# Altium schematic sheet Control_Sense_BOTT.SchDoc (part 5 of 5)
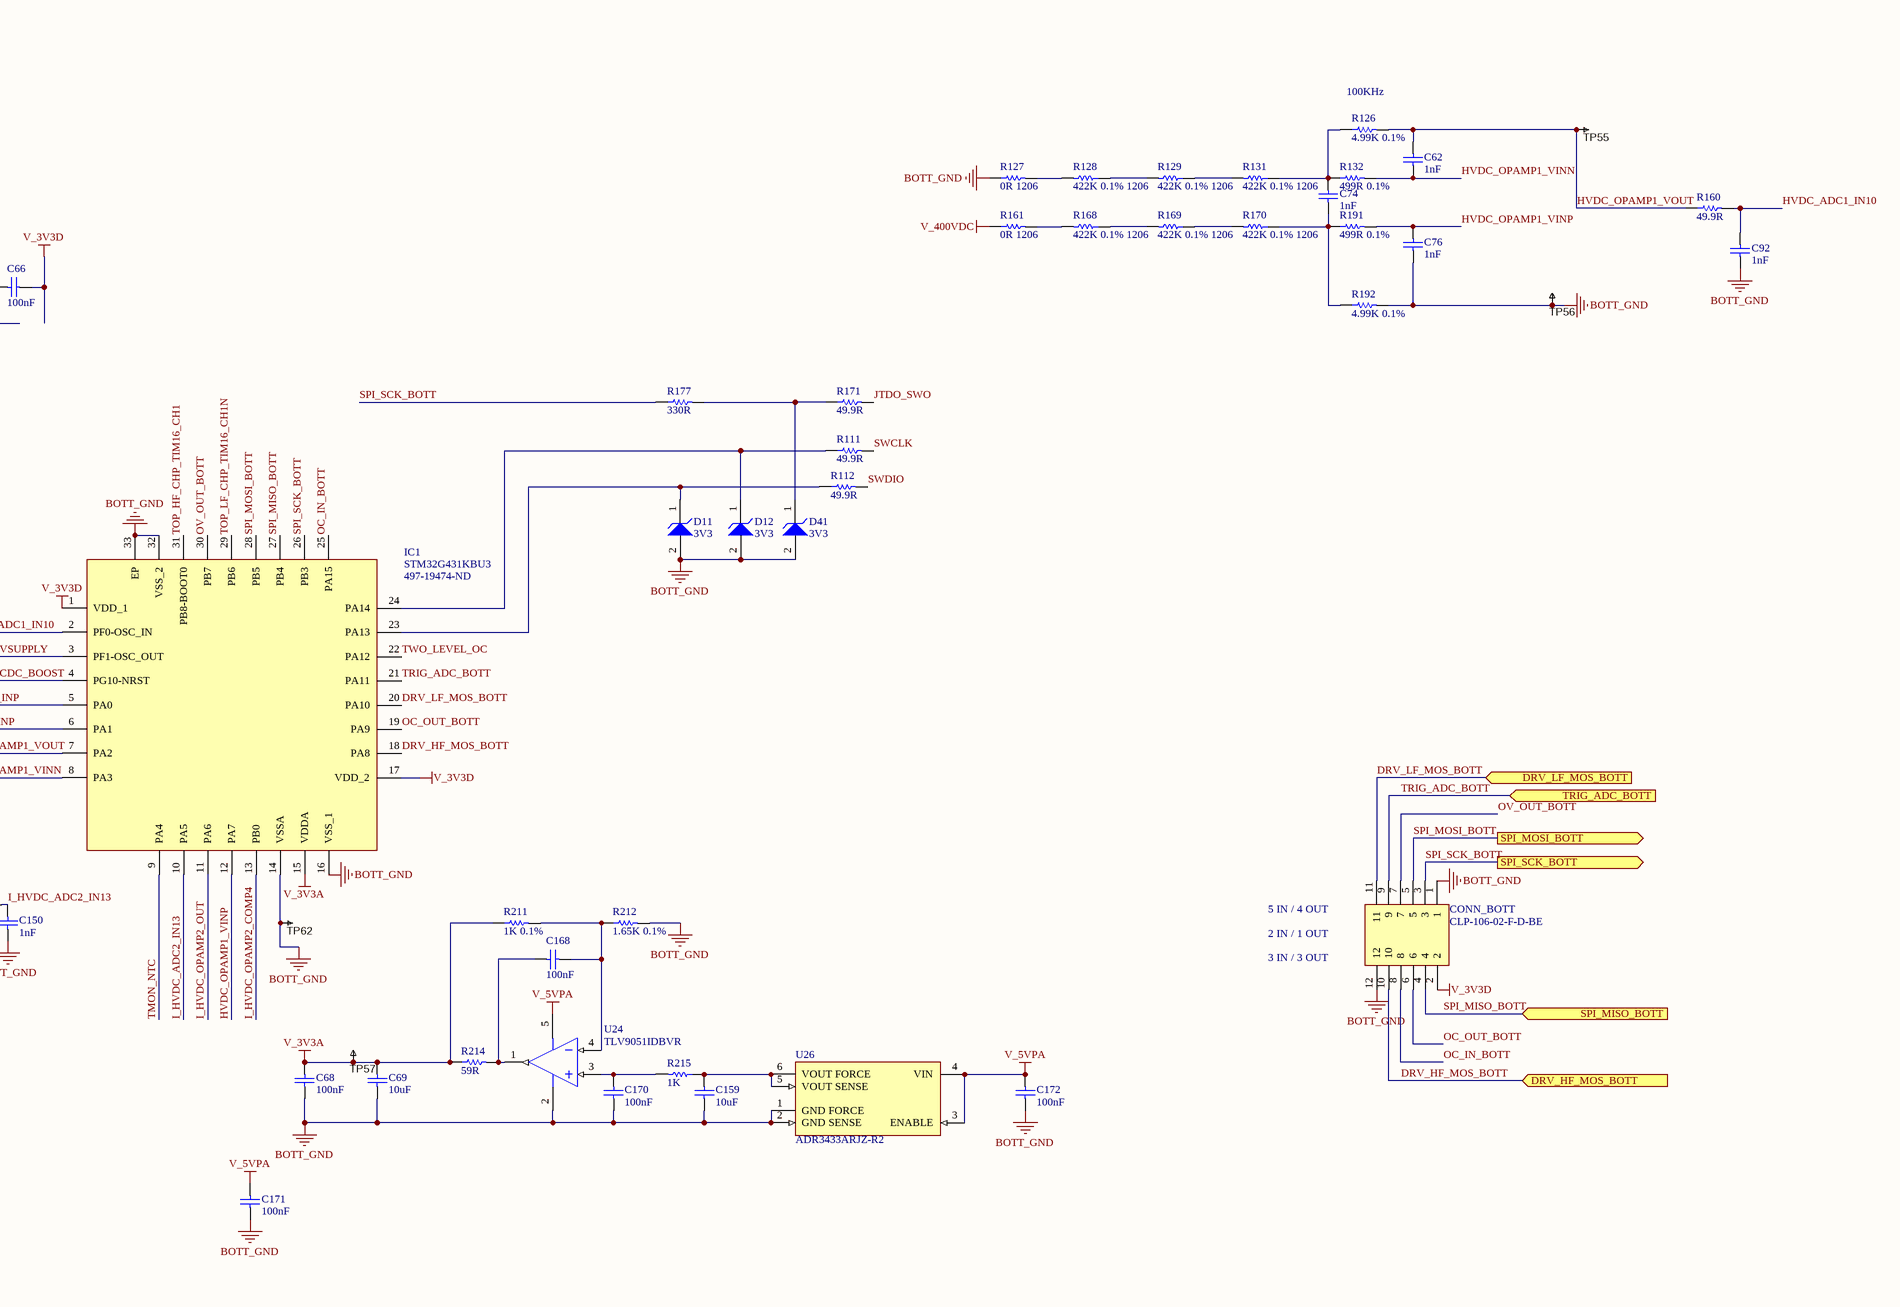
[diagram p9: Control_Sense_BOTT.SchDoc, bottom right]

## Library data of the parts (continued)
R257 = RES-2: Chip Resistor, 0 Ohm, +/- 5%, 0.1 W, -55 to 155 degC, 0603 (1608 Metric), RoHS, Tape and Reel; Manufacturer: Yageo; Manufacturer Part Number: RC0603JR-070RL; Temperature Coefficient: 200ppm/degreesC; Voltage Rating: 50V; Power Rating: 100mW; Resistance: 0mOhm; Width: 0.8mm; Max Operating Temperature: 155degC; Tolerance: 5%; Package Reference: 0603; Height: 0.45mm; Depth: 0.8mm; Package Description: 2-Pin Surface Mount Device, Body 1.6 x 0.8 mm; Termination: SMD/SMT; Package Quantity: 5000; Case/Package: 0603; Case Code (Imperial): 0603; Radiation Hardening: No; Number of Pins: 2; Length: 1.6mm; Lead Free: LeadFree; Voltage Rating (DC): 50V; Military Standard: Not; Datasheet URL: http://www.yageo.com/NewPortal/yageodocoutput?fileName=/pdf/R-Chip/PYu-RC_Group_51_RoHS_L_5.pdf; Manufacturer URL: http://www.yageo.com/; Packaging: TapeandReel; Case Code (Metric): 1608; Min Operating Temperature: -55degC; Composition: ThickFilm; RoHSCompliant: true; Contact Plating: Tin; Datasheet Version: Rev. 5, 10/2016; REACH SVHC: NoSVHC; Supplier 1: Avnet; Supplier Part Number 1: RC0603JR-070RL; RoHS: Yes; Category: Chip SMD Resistors; Stock 1: 1330000; Pricing 1: 5000=0.00138, 10000=0.00136, 20000=0.00132, 30000=0.00129, 40000=0.00124, 50000=0.00121, 500000=0.00118 (USD); Size Code: 0603; Resistor Type: Thick Film; Series: RC; Max Power Dissipation: 100mW; Construction: Rectangular; Number of Terminations: 2; Features: Moisture Resistant; Technology: THICK FILM; Resistance Tolerance: 5%; RoHS Compliant: Yes; ComponentLink1URL: https://datasheet.ciiva.com/11808/pyu-r-int-6-11808700.pdf?src-supplier=RSComponents; ComponentLink1Description: https://datasheet.ciiva.com/11808/pyu-r-int-6-11808700.pdf?src-supplier=RSComponents; ComponentLink2URL: https://datasheet.ciiva.com/22747/443971-22747530.pdf?src-supplier=Element14; ComponentLink2Description: https://datasheet.ciiva.com/22747/443971-22747530.pdf?src-supplier=Element14; ComponentLink3URL: https://datasheet.ciiva.com/12555/rc0603-272842-12555254.pdf?src-supplier=Mouser; ComponentLink3Description: https://datasheet.ciiva.com/12555/rc0603-272842-12555254.pdf?src-supplier=Mouser; ComponentLink4URL: https://datasheet.ciiva.com/7746/1738695-7746421.pdf?src-supplier=Element14; ComponentLink4Description: https://datasheet.ciiva.com/7746/1738695-7746421.pdf?src-supplier=Element14; ComponentLink5URL: https://datasheet.ciiva.com/7746/1738695-7746422.pdf?src-supplier=Element14; ComponentLink5Description: https://datasheet.ciiva.com/7746/1738695-7746422.pdf?src-supplier=Element14; ComponentLink6URL: https://datasheet.ciiva.com/8883/pyu-rc0603-51-rohs-l-4-8883045.pdf?src-supplier=Avnet; ComponentLink6Description: https://datasheet.ciiva.com/8883/pyu-rc0603-51-rohs-l-4-8883045.pdf?src-supplier=Avnet; ComponentLink7URL: https://datasheet.ciiva.com/15189/getdatasheetpartid-329462-15189845.pdf?src-supplier=Verical; ComponentLink7Description: https://datasheet.ciiva.com/15189/getdatasheetpartid-329462-15189845.pdf?src-supplier=Verical
R258 = RES: ±1% ±400ppm/℃ 5.1Ω 0.1W 0603 Chip Resistor - Surface Mount ROHS; Part Number: ERJ3EKF1803V; Manufacturer: Panasonic; Manufacturer Part Number: ERJ-3EKF1803V; Resistance: 180kR; Power Rating: 100mW; Voltage Rating: 75V; Temperature Coefficient: 100ppm/°C; Supplier 1: Digi-Key; Supplier Part Number 1: P180KHCT-ND; RoHS: Yes; Category: Chip SMD Resistors; Stock 1: 113875; Pricing 1: 1=0.10000, 10=0.06100, 100=0.02460, 1000=0.01106, 2500=0.00960 (USD); Mount: Surface Mount; Case/Package: 0603; Case Code (Metric): 1608; Case Code (Imperial): 0603; Contact Plating: Tin; Weight: 7.1E-05oz; Min Operating Temperature: -55°C; Max Operating Temperature: 155°C; Tolerance: 1%; Packaging: Tape and Reel; Resistor Type: Thick Film; Series: ERJ; Package Quantity: 1; Number of Terminations: 2; Termination: SMD/SMT; Max Power Dissipation: 100mW; Voltage Rating (DC): 75V; Construction: Rectangular; Features: Automotive AEC-Q200; Resistance Tolerance: 1%; Length: 1.6mm; Width: 0.031inch; Height: 0.022inch; Depth: 0.8mm; Radiation Hardening: No; RoHS Compliant: Yes; Military Standard: Not; Lead Free: Lead Free; REACH SVHC: No SVHC; ComponentLink1URL: https://datasheet.ciiva.com/22739/426256-22739797.pdf?src-supplier=Element14; ComponentLink1Description: https://datasheet.ciiva.com/22739/426256-22739797.pdf?src-supplier=Element14; ComponentLink2URL: https://datasheet.ciiva.com/24162/aoa0000ce2-24162661.pdf?src-supplier=Mouser; ComponentLink2Description: https://datasheet.ciiva.com/24162/aoa0000ce2-24162661.pdf?src-supplier=Mouser; ComponentLink3URL: https://datasheet.ciiva.com/30137/aoa0000ce2-30137813.pdf?src-supplier=Onlinecomponents.com; ComponentLink3Description: https://datasheet.ciiva.com/30137/aoa0000ce2-30137813.pdf?src-supplier=Onlinecomponents.com; ComponentLink4URL: https://datasheet.ciiva.com/46436/1678782-46436790.pdf?src-supplier=Element14; ComponentLink4Description: https://datasheet.ciiva.com/46436/1678782-46436790.pdf?src-supplier=Element14; ComponentLink5URL: https://datasheet.ciiva.com/46436/1678782-46436791.pdf?src-supplier=Element14; ComponentLink5Description: https://datasheet.ciiva.com/46436/1678782-46436791.pdf?src-supplier=Element14; ComponentLink6URL: https://datasheet.ciiva.com/16782/70260748-16782408.pdf?src-supplier=Allied+Electronics; ComponentLink6Description: https://datasheet.ciiva.com/16782/70260748-16782408.pdf?src-supplier=Allied+Electronics; ComponentLink7URL: https://datasheet.ciiva.com/17207/aoa0000ce2-17207208.pdf?src-supplier=Avnet+Europe; ComponentLink7Description: https://datasheet.ciiva.com/17207/aoa0000ce2-17207208.pdf?src-supplier=Avnet+Europe; ComponentLink8URL: https://datasheet.ciiva.com/28568/1678782-28568699.pdf?src-supplier=Element14; ComponentLink8Description: https://datasheet.ciiva.com/28568/1678782-28568699.pdf?src-supplier=Element14; ComponentLink9URL: https://datasheet.ciiva.com/5915/aoa0000ce2-5915294.pdf?src-supplier=Farnell; ComponentLink9Description: https://datasheet.ciiva.com/5915/aoa0000ce2-5915294.pdf?src-supplier=Farnell; ComponentLink10URL: https://datasheet.ciiva.com/9184/aoa0000ce2-9184911.pdf?src-supplier=Avnet; ComponentLink10Description: https://datasheet.ciiva.com/9184/aoa0000ce2-9184911.pdf?src-supplier=Avnet; Parameter 1: *; JLCPCB Part #: C25197
R262 R263 = CMP-2001-00026-5: ±1% 2kΩ ±100ppm/℃ 0.125W 0805 Chip Resistor - Surface Mount ROHS; Manufacturer: Panasonic; Voltage Rating: 150 V; RoHSCompliant: true; Packaging: Tape and Reel; ComponentLink2Description: Datasheet; DatasheetVersion: 04/2015; Min Operating Temperature: -55 degC; Max Operating Temperature: 155 degC; Mounting Technology: Surface Mount; Length: 2 mm; Package Quantity: 5000; REACH SVHC: Unknown; ComponentLink1URL: http://www.panasonic.com/; ComponentLink2URL: http://industrial.panasonic.com/cdbs/www-data/pdf/RDA0000/AOA0000C86.pdf; Mount: Surface Mount; PackageReference: 0805; ComponentLink1Description: Manufacturer URL; PackageDescription: 2-Pin Surface Mount Device, Body 2 x 1.25 mm; Height: 0.6 mm; JLCPCB Part #: C17604
TP41-TP62 = TESTPOINT: SMD test pin
U3 = TI-LP2951-D8: Single Output LDO, 100 mA, 1.2 to 29 V Output, 2 to 30 V Input, -40 to 125 degC, 8-Pin SOIC (D), RoHS, Tape and Reel; Manufacturer: Texas Instruments; Iq (Typ) (mA): 0.075; Output Options: Adjustable Output; Output Capacitor Type: Non-Ceramic; Vdo (Typ) (mV): 380; Vin (Max) (V): 30; Vout (Min) (V): 1.2; Vin (Min) (V): 2; Rating: Catalog; Accuracy (%): 1.4; Iout (Max) (A): 0.1; Vout (Max) (V): 29; ComponentLink1URL: http://www.ti.com/; PackageReference: D0008A; Operating Temperature Range (C): -40 to 125; ComponentLink3Description: Package Specification; ComponentLink1Description: Manufacturer URL; ComponentLink2URL: http://www.ti.com/lit/ds/symlink/lp2950-30.pdf; DatasheetVersion: SLVS582H; ComponentLink2Description: Datasheet; RoHS: TRUE; Packing: Tape and Reel; PartNumber: LP2951DR; PackageVersion: 4040047-3/M; Mounting Technology: Surface Mount; PackageDescription: 8-Pin Plastic Small Outline, Body 3.9 x 4.9 mm, Pitch 1.27 mm; ComponentLink3URL: http://www.ti.com/lit/ml/msoi002j/msoi002j.pdf
U6 U7 = CMP-0366-01377-2: Adjustable Precision Shunt Regulator, 34 ppm / degC, 100 mA, -40 to 85 degC, 3-pin SOT-89 (PK), Green (RoHS & no Sb/Br); Manufacturer: Texas Instruments; Rating: Military; SubFamily: Shunt Voltage Reference; Min Iz for Regulation(uA): 600; Initial Accuracy @ 25/deg C(%): 2; Temp Coeff(Typ)(ppm/ degree C): 34; Temp Coeff(Max)(ppm/ degree C): 92; VO Adj(Min)(V): 2.495; Iout/Iz(Max)(mA): 100; VO Adj(Max)(V): 36; Eco-Plan: Green (RoHS & no Sb/Br); Code_JEDEC: TO-243; DatasheetVersion: SLVS543M; ComponentLink1URL: http://www.ti.com/; PackageReference: PK0003A; PackageDescription: 3-Pin Plastic Small Outline, Body 2.5 x 4.5 mm, Pitch 1.5 mm; PackageVersion: 4040234/D; ComponentLink3URL: http://www.ti.com/litv/pdf/mhsi001b; PartNumber: TL431IPK; ComponentLink3Description: Package Specification; ComponentLink2URL: http://www.ti.com/general/docs/lit/getliterature.tsp?genericPartNumber=TL431&fileType=pdf; Mounting Technology: Surface Mount; ComponentLink2Description: Datasheet; ComponentLink1Description: Manufacturer URL
U10 U15 = CMP-0859-00394-3: Single 2-Input Positive-AND Gate, DCK0005A, SMALL T&R; Generic Part Number: SN74AHC1G08; Manufacturer: Texas Instruments; Schmitt Trigger: No; ICC @ Nom Voltage(Max)(mA): 0.01; Technology Family: AHC; Output Drive (IOL/IOH)(Max)(mA): 50/-50; tpd @ Nom Voltage(Max)(ns): 12.3,7.9; Logic: True; Gate Type: AND; VCC(Min)(V): 2; Input Type: CMOS; Voltage(Nom)(V): 3.3,5; Bits(#): 1; VCC(Max)(V): 5.5; F @ Nom Voltage(Max)(Mhz): 75; Rating: Catalog; 3-State Output: No; Operating Temperature Range(C): -55 to 125; DatasheetVersion: SCLS314N; Sub-Family: AND Gate; Output Type: CMOS; PackageReference: DCK0005A
U11 U16 = CMP-0859-00258-3: Single Bus Buffer Gate With 3-State Output, DCK0005A, LARGE T&R; Manufacturer: Texas Instruments; Bits(#): 1; 3-State Output: Yes; Input Type: CMOS; VCC(Min)(V): 2; Schmitt Trigger: No; Rating: Catalog; tpd @ Nom Voltage(Max)(ns): 6; Voltage(Nom)(V): 5; Technology Family: AHCT; ICC @ Nom Voltage(Max)(mA): 0.01; Output Drive (IOL/IOH)(Max)(mA): 8/-8; Sub-Family: Non-Inverting Buffer/Driver; VCC(Max)(V): 5.5; F @ Nom Voltage(Max)(Mhz): 75; Logic: True; Generic Part Number: SN74AHCT1G126; Operating Temperature Range(C): -40 to 125; Output Type: CMOS; PackageReference: DCK0005A; DatasheetVersion: SCLS380J
U14 = PM-LINEREG-TC1014-IL5: 50 mA, 100 mA and 150 mA CMOS LDOs with Active-Low Shutdown and Reference Bypass, 5-Pin SOT-23, Extended Temperature, Tape and Reel; PackageVersion: revBB, Aug-2009; Code_IPC: SOT23-5; PackageDescription: 5-Lead Plastic Small Outline Transistor (CT) [SOT-23]; DatasheetVersion: revE, Feb-2007; PackageReference: SOT-23-CT5
U23 = PM-CHP-LM2661M-8: Switched Capacitor Voltage Converter, 8-pin Narrow SOIC, Pb-Free; Manufacturer: Texas Instruments; PackageTopMarking: NSZXTT*LM26*63M; CompType: Switch Caps; PowerWise: N; Code_IPC: SOIC127P600-8; PinCount: 8; ComponentLink1Description: Datasheet URL; PackageReference: D0008A; Code_JEDEC: MS-012-AA; PackageDescription: SOIC Narrow, 4.9 x 3.9 x 1.45mm, 8 Lead, 1.27mm Pitch; ComponentLink1URL: http://www.ti.com/general/docs/lit/getliterature.tsp?genericPartNumber=LM2663&fileType=pdf; RoHS: Y
U24 U34 = CMP-0187-00454-2: 2.8 MHz, 150 Î¼A Op Amp, 5-Pin SOT-23, Extended Temperature Range, Tape and Reel; Code_IPC: SOT23-5; PackageDescription: 5-Lead Plastic Small Outline Transistor (OT) [SOT-23]; PackageReference: SOT-23-OT5; ComponentLink3URL: http://www.microchip.com/stellent/groups/techpub_sg/documents/packagingspec/en012702.pdf; ComponentLink1Description: Manufacturer URL; ComponentLink2URL: http://ww1.microchip.com/downloads/en/DeviceDoc/22145a.pdf; ComponentLink2Description: Datasheet; PackageVersion: revBB, Aug-2009; RevisionNote: URLs added.; ComponentLink1URL: http://www.microchip.com/; DatasheetVersion: revA, Mar-2009; ComponentLink3Description: Package Specification
U26 = ADI-ADR34xx-RJ-6: Micropower, High Accuracy Voltage Reference, 3.3 V Output, 3.5 to 5.5 V Supply, Industrial, 6-pin SOT23 (RJ-6), Reel; Manufacturer: Analog Devices; Ref Out TC (ppm/C): 8; Vout: 3.3V; Min V Supply (V): 3.5; Max V Supply (V): 5.5; PartNumber: ADR3433ARJZ-R2; Mounting Technology: Surface Mount; ComponentLink1URL: http://www.analog.com/en/index.html; ComponentLink1Description: Manufacturer URL; PackageVersion: 121608-A, 12/2008; Operating Temp Range: -40 to 125 degC; Packing: Reel; ComponentLink2Description: Datasheet; PackageDescription: 6-Pin Small Outline Transistor Package, Body 2.9 x 1.6 mm, Pitch 0.95 mm; ComponentLink4Description: URL Link1; ComponentLink3Description: Package Specification; Code_JEDEC: MO-178-AB; DatasheetVersion: Rev. B; PackageReference: RJ-6; ComponentLink4URL: Product URL:http://www.analog.com/en/special-linear-functions/voltage-references/adr3433/products/product.html; ComponentLink3URL: http://www.analog.com/static/imported-files/packages/PKG_PDF/SOT-23(RJ)/RJ_6.pdf; ComponentLink2URL: http://www.analog.com/static/imported-files/data_sheets/ADR3412_ADR3420_ADR3425_ADR3430_ADR3433_ADR3440_ADR3450.pdf
U35 U36 = 1EDN8550B: Single-channel EiceDRIVER™ with true  differential inputs
U37 = CMP-0366-01210-2: Adjustable Precision Shunt Regulator, 34 ppm / degC, 100 mA, -40 to 125 degC, 3-pin SOT-23 (DBZ), Green (RoHS & no Sb/Br); Manufacturer: Texas Instruments; Iout/Iz(Max)(mA): 100; Min Iz for Regulation(uA): 600; SubFamily: Shunt Voltage Reference; Temp Coeff(Typ)(ppm/ degree C): 34; VO Adj(Max)(V): 36; Rating: Catalog; Initial Accuracy @ 25/deg C(%): 1; VO Adj(Min)(V): 2.495; Temp Coeff(Max)(ppm/ degree C): 92; PackageReference: DBZ0003A; ComponentLink1Description: Manufacturer URL; Mounting Technology: Surface Mount; ComponentLink2URL: http://www.ti.com/general/docs/lit/getliterature.tsp?genericPartNumber=TL431A&fileType=pdf; PackageVersion: 4203227/B; ComponentLink2Description: Datasheet; PackageDescription: 3-Pin Plastic Small Outline, Body 2.92 x 1.3 mm, Pitch 0.95 mm; ComponentLink1URL: http://www.ti.com/; Eco-Plan: Green (RoHS & no Sb/Br); Code_JEDEC: TO-236; ComponentLink3URL: http://www.ti.com/litv/pdf/mpds108a; DatasheetVersion: SLVS543M; ComponentLink3Description: Package Specification; PartNumber: TL431AQDBZR
U40 = LM51571QRTERQ1: Integrated Circuit; Manufacturer_Name: Texas Instruments; Datasheet Link: https://www.ti.com/lit/ds/symlink/lm51571-q1.pdf?ts=1617256844020&ref_url=https%253A%252F%252Fwww.ti.com%252Fstore%252Fti%252Fen%252Fp%252Fproduct%252F%253Fp%253DLM51571QRTERQ1; Height: 0.8mm; Manufacturer_Part_Number: LM51571QRTERQ1; Mouser Part Number: 595-LM51571QRTERQ1; Mouser Price/Stock: https://www.mouser.co.uk/ProductDetail/Texas-Instruments/LM51571QRTERQ1?qs=DRkmTr78QATLeGZjuFYyEQ%3D%3D; Arrow Part Number: LM51571QRTERQ1; Arrow Price/Stock: https://www.arrow.com/en/products/lm51571qrterq1/texas-instruments?region=nac